# EAGLE design transistor-test-v3 (EAGLE 9.4.1)
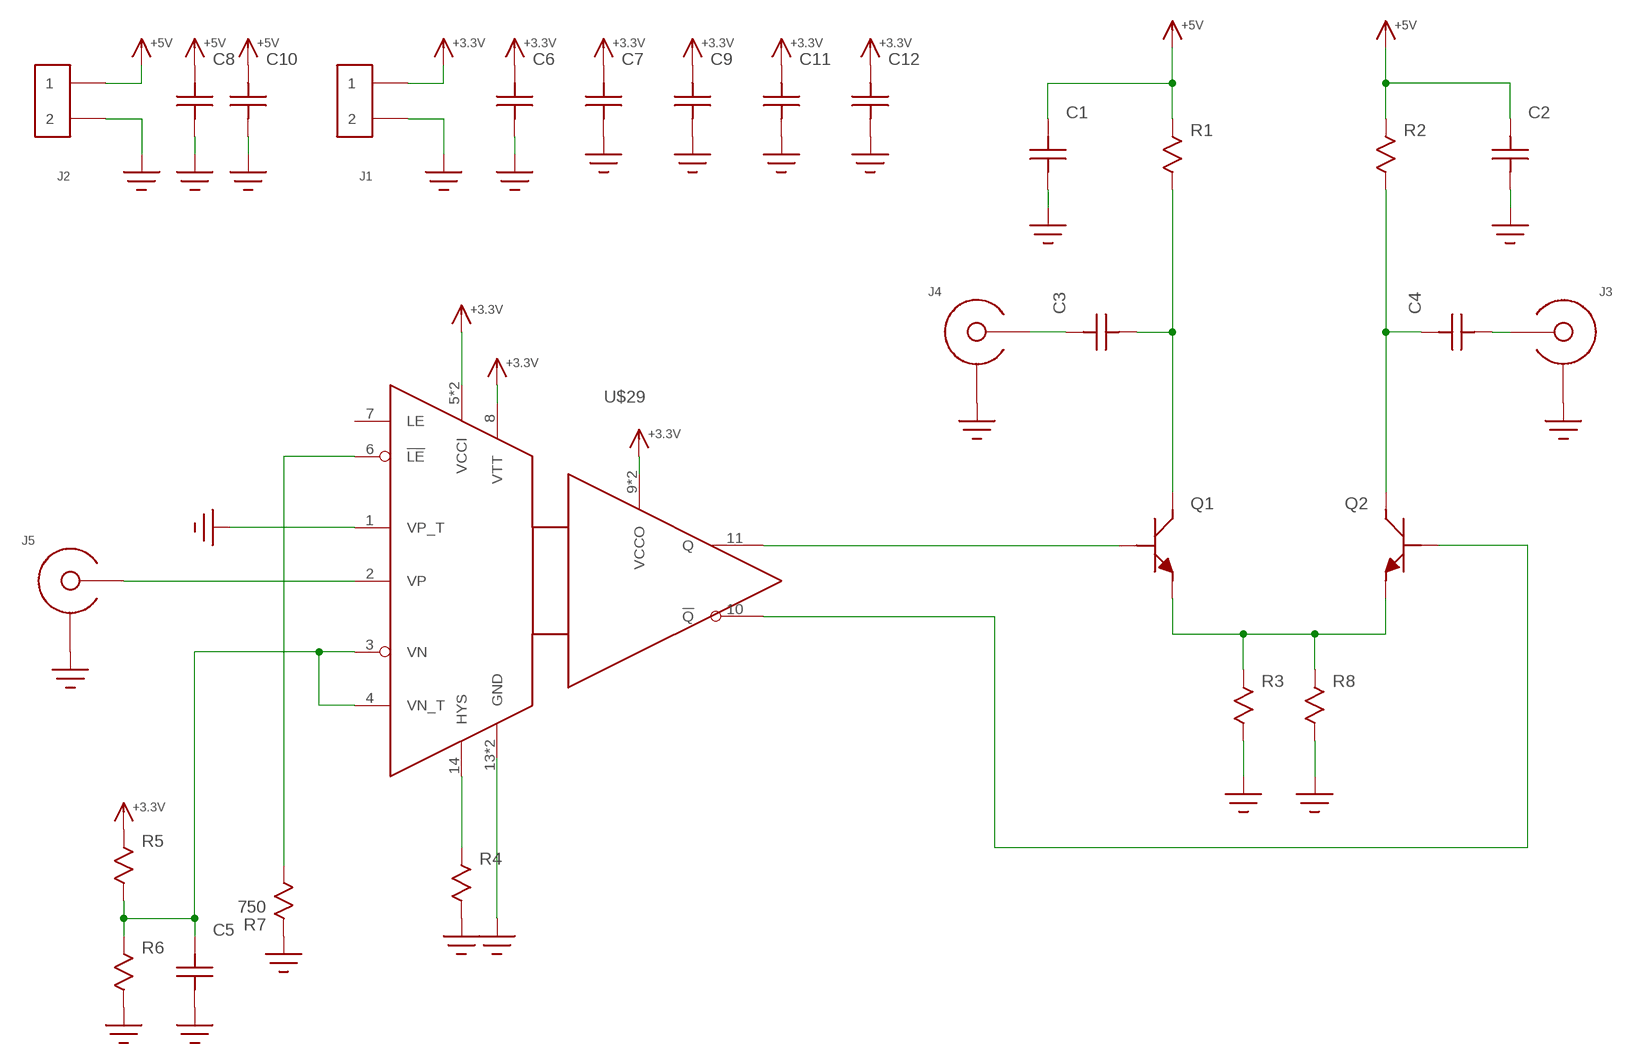
[diagram p0: schematic, sheet 1]

## Parts
C1  C0603  [C0603]
C2  C0603  [C0603]
C3  C0603  [C0603]
C4  C0603  [C0603]
C5  C0603  [C0603]
C6  C1206  [1206]
C7  C0603  [C0603]
C8  C1206  [1206]
C9  C0603  [C0603]
C10  C1206  [1206]
C11  C0603  [C0603]
C12  C0603  [C0603]
J1  HEADER_2PIN  [HEADER_2PIN]
J2  HEADER_2PIN  [HEADER_2PIN]
J3  SMA-EDGE-LAUNCH4L_4030_TAPER  [SMA_EDGE_LAUNCH_4L_4030_TAPER]
J4  SMA-EDGE-LAUNCH4L_4030_TAPER  [SMA_EDGE_LAUNCH_4L_4030_TAPER]
J5  SMA-EDGE-LAUNCH4L_4030_TAPER  [SMA_EDGE_LAUNCH_4L_4030_TAPER]
Q1  MCH4020  [SOT343]
Q2  MCH4020  [SOT343]
R1  R0603  [R0603]
R2  R0603  [R0603]
R3  R0603  [R0603]
R4  R0603  [R0603]
R5  R0603  [R0603]
R6  R0603  [R0603]
R7  750  R0603  [R0603]
R8  R0603  [R0603]
U$29  ADCMP572  [TQFN16-EP]

## Nets
+3.3V: C6.P$2 C7.P$2 C9.P$2 C11.P$2 C12.P$2 J1.1 R5.P$1 U$29.5(VCCI) U$29.8(VTT) U$29.9(VCCO) U$29.12(VCCO) U$29.16(VCCI)
+5V: C1.P$2 C2.P$2 C8.P$2 C10.P$2 J2.1 R1.P$1 R2.P$1
GND: C1.P$1 C2.P$1 C5.P$1 C6.P$1 C7.P$1 C8.P$1 C9.P$1 C10.P$1 C11.P$1 C12.P$1 J1.2 J2.2 J3.BOTTOM_GND(SHIELD) J3.GND@1(SHIELD) J3.GND@2(SHIELD) J3.GND@3(SHIELD) J3.GND@4(SHIELD) J3.GND@5(SHIELD) J3.GND@6(SHIELD) J3.GND@7(SHIELD) J3.GND@8(SHIELD) J3.GND@14(SHIELD) J3.GND@15(SHIELD) J3.GND@16(SHIELD) J3.GND@17(SHIELD) J3.GND_PAD1(SHIELD) J3.GND_PAD2(SHIELD) J3.P$1(SHIELD) J3.P$2(SHIELD) J4.BOTTOM_GND(SHIELD) J4.GND@1(SHIELD) J4.GND@2(SHIELD) J4.GND@3(SHIELD) J4.GND@4(SHIELD) J4.GND@5(SHIELD) J4.GND@6(SHIELD) J4.GND@7(SHIELD) J4.GND@8(SHIELD) J4.GND@14(SHIELD) J4.GND@15(SHIELD) J4.GND@16(SHIELD) J4.GND@17(SHIELD) J4.GND_PAD1(SHIELD) J4.GND_PAD2(SHIELD) J4.P$1(SHIELD) J4.P$2(SHIELD) J5.BOTTOM_GND(SHIELD) J5.GND@1(SHIELD) J5.GND@2(SHIELD) J5.GND@3(SHIELD) J5.GND@4(SHIELD) J5.GND@5(SHIELD) J5.GND@6(SHIELD) J5.GND@7(SHIELD) J5.GND@8(SHIELD) J5.GND@14(SHIELD) J5.GND@15(SHIELD) J5.GND@16(SHIELD) J5.GND@17(SHIELD) J5.GND_PAD1(SHIELD) J5.GND_PAD2(SHIELD) J5.P$1(SHIELD) J5.P$2(SHIELD) R3.P$2 R4.P$2 R6.P$2 R7.P$1 R8.P$2 U$29.1(VP_T) U$29.13(GND) U$29.15(GND)
N$3: Q1.2(E) Q1.4(E) Q2.2(E) Q2.4(E) R3.P$1 R8.P$1
N$4: R4.P$1 U$29.14(HYS)
N$5: Q2.3(B) U$29.10(!Q!)
N$6: C3.P$2 J4.CENTER@1(CENTER)
N$7: C4.P$1 J3.CENTER@1(CENTER)
N$8: C5.P$2 R5.P$2 R6.P$1 U$29.3(VN) U$29.4(VN_T)
N$9: R7.P$2 U$29.6(!LE!)
N$10: J5.CENTER@1(CENTER) U$29.2(VP)
N$11: C3.P$1 Q1.1(C) R1.P$2
N$12: C4.P$2 Q2.1(C) R2.P$2
N$13: Q1.3(B) U$29.11(Q)
Unconnected: U$29.7(LE)

## Library data of the parts
C1-C12 = yapo:C
J1 J2 = yapo:HEADER_2PIN
J3-J5 = sma_footprint_2l:SMA-EDGE-LAUNCH
Q1 Q2 = yapo:MCH4020
R1-R8 = yapo:R
U$29 = yapo:ADCMP572

## Net classes
1 50-ohm: width 0.356 mm, clearance 0.508 mm

## Board
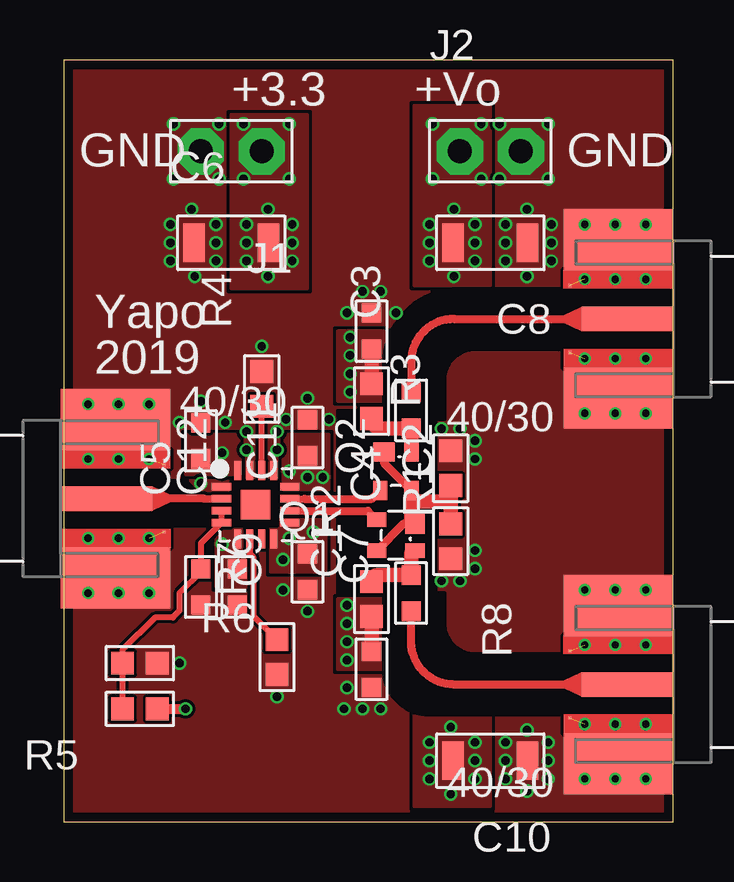
[diagram p1: board, top side]
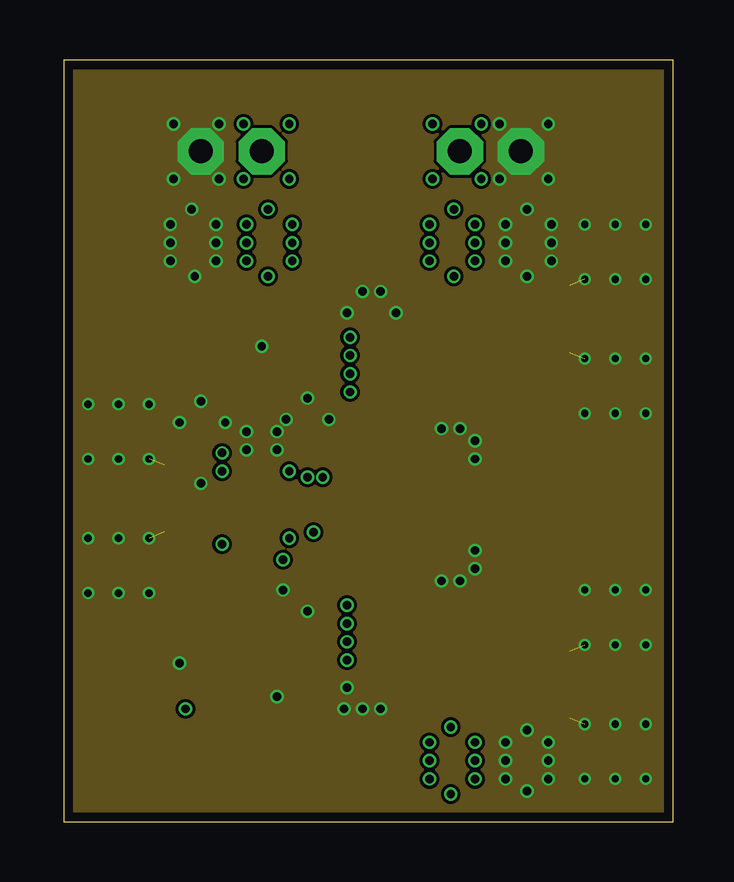
[diagram p2: board, inner layer Route2]
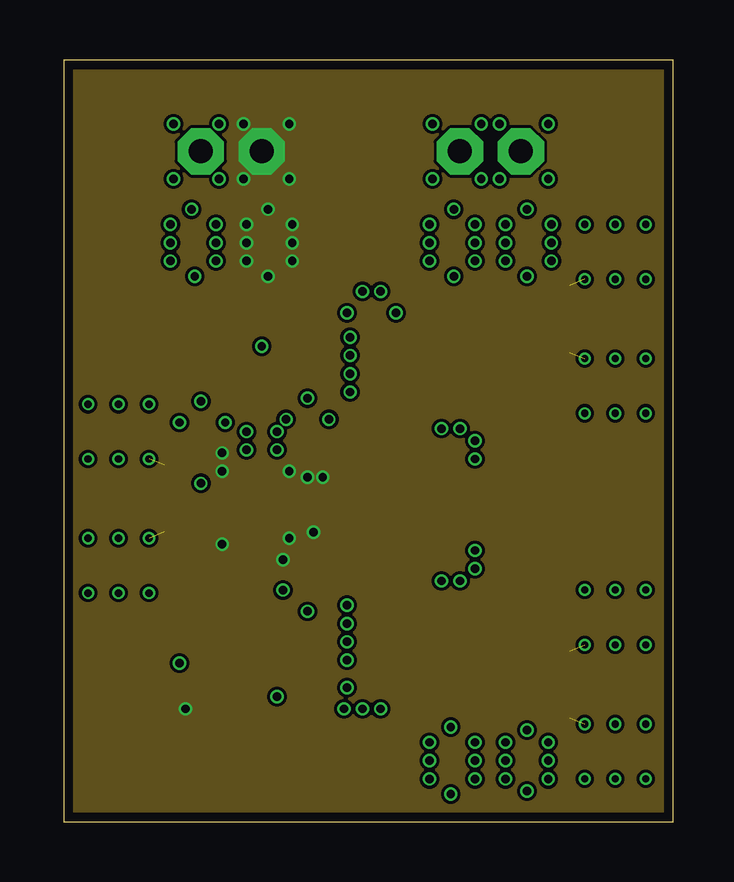
[diagram p3: board, inner layer Route15]
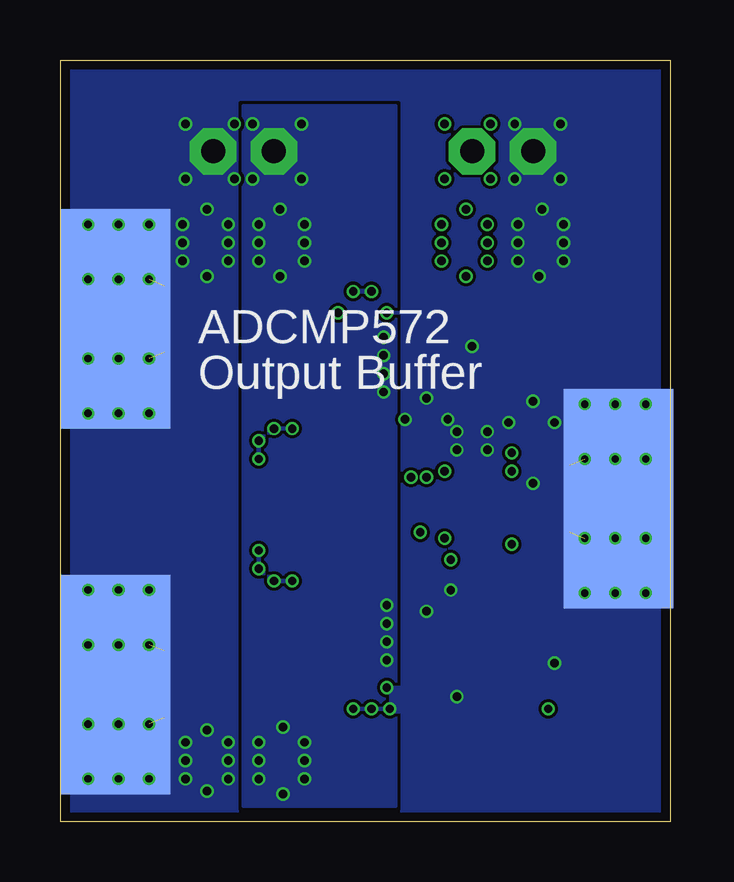
[diagram p4: board, bottom side, seen from below]

Size 25.4 x 31.75 mm. Coordinates in mm from the lower left corner, seen from the top.
Outline: 0,0 25.4,0 25.4,31.75 0,31.75 0,0
Copper layers (1*2*15*16): Top 0.035559375mm / dielectric 0.17018125mm / Route2 0.01778125mm / dielectric 47mil / Route15 0.01778125mm / dielectric 0.17018125mm / Bottom 0.035559375mm
Design rules "oshpark-4layer *": minimum track width 5mil, minimum drill 10mil, track to track 5mil, track to pad 5mil, pad to pad 5mil, via to via 5mil, smd to smd 5mil, copper to edge 15mil, drill to drill 6mil, minimum pad ring 4mil, minimum via ring 4mil, stop-mask expansion 2.5mil, vias tented up to drill 20mil, thermal gap 10mil

### Footprints (pad centres in the part's own frame; a part is rotated, then mirrored left to right if it is on the bottom)
C0603 = smd 0.8 x 0.8: P$1 -0.75,0; P$2 0.75,0
1206 = smd 0.9 x 1.6: P$1 -1.55,0; P$2 1.55,0
HEADER_2PIN = drill 1 pad 1.93 octagon: 1 -1.27,0; 2 1.27,0
SMA_EDGE_LAUNCH_4L_4030_TAPER = smd 4.572 x 9.144 bottom: BOTTOM_GND 2.286,0 | smd 3.81 x 1.016: CENTER@1 1.905,0 | drill 0.3: GND@1 1.143,3.937; GND@2 3.683,3.937; GND@3 1.143,1.651; GND@4 3.683,1.651; GND@5 1.143,-1.651; GND@6 3.683,-1.651; GND@7 1.143,-3.937; GND@8 3.683,-3.937; GND@14 2.413,3.937; GND@15 2.413,-3.937; GND@16 2.413,-1.651; GND@17 2.413,1.651 | smd 4.572 x 2.54: GND_PAD1 2.286,3.302; GND_PAD2 2.286,-3.302 | smd 0.127 x 0.127: P$1 4.318,1.397; P$2 4.318,-1.397
SOT343 = smd 0.6 x 0.8: 1 -0.65,-0.8; 3 0.65,0.8; 4 -0.65,0.8 | smd 0.9 x 0.8: 2 0.5,-0.8
R0603 = smd 0.95 x 0.95: P$1 -0.725,0; P$2 0.725,0
TQFN16-EP = smd 0.3 x 0.8: 1 -0.75,-1.425; 2 -0.25,-1.425; 3 0.25,-1.425; 4 0.75,-1.425; 9 0.75,1.425; 10 0.25,1.425; 11 -0.25,1.425; 12 -0.75,1.425 | smd 0.8 x 0.3: 5 1.425,-0.75; 6 1.425,-0.25; 7 1.425,0.25; 8 1.425,0.75; 13 -1.425,0.75; 14 -1.425,0.25; 15 -1.425,-0.25; 16 -1.425,-0.75 | smd 1.23 x 1.23: EP 0,0

### Placement (x,y rotation side)
C1  12.83,6.35 90 top
C2  12.83,20.45 270 top
C3  14.48,17.14 90 top
C4  14.48,9.53 90 top
C5  5.71,9.78 90 top
C6  6.99,24.13 0 top
C7  10.16,16 270 top
C8  17.78,24.13 180 top
C9  5.71,15.88 270 top
C10  17.78,2.54 180 top
C11  10.16,10.41 90 top
C12  7.24,9.78 90 top
J1  6.99,27.94 180 top
J2  17.78,27.94 0 top
J3  25.4,5.71 180 top
J4  25.4,20.95 180 top
J5  -0.13,13.46 0 top
Q1  13.84,14.61 180 top
Q2  13.84,11.94 90 top
R1  12.83,17.53 270 top
R2  12.83,9.27 90 top
R3  16.13,14.73 90 top
R4  8.26,18.03 90 top
R5  3.17,4.7 180 top
R6  3.17,6.6 0 top
R7  8.89,6.86 90 top
R8  16.13,11.68 270 top
U$29  8,13.21 270 top

### Tracks (layer width: path | path; a pad name or v marks a point on that pad's centre or on a via)
+3.3V  (via drill 0.35)
  Top 0.406: R5.P$1 v5.08,4.7
  other vias: 9.4,11.81 9.14,10.92 10.41,12.06 6.6,11.56 6.6,14.61 9.4,14.61 6.6,15.37 10.16,14.35 10.79,14.35 7.49,29.08 9.4,29.08 9.4,26.8 7.49,26.8 8.51,25.53 8.51,22.73 7.62,24.89 7.62,24.13 7.62,23.37 9.53,24.89 9.53,24.13 9.53,23.37
  pour Route15 (no thermals): 0,0 25.4,0 25.4,31.75 0,31.75
  pour Top (no thermals): 6.99,29.46 6.99,22.23 10.16,22.23 10.16,29.46
  pour Top (no thermals): 8.89,12.32 8.64,12.32 8.64,10.41 10.92,10.41 10.92,12.57 8.89,12.57
  pour Top (no thermals): 7.62,12.32 6.35,12.32 6.35,9.78 7.62,9.78
  pour Top (no thermals): 5.08,16.13 7.37,16.13 7.37,14.48 5.08,14.48
  pour Top (no thermals): 9.14,13.84 9.14,16.13 11.05,16.13 11.05,13.84
+5V  (via drill 0.35)
  Top 0.61: C1.P$2 R2.P$1 | C2.P$2 R1.P$1
  other vias: 15.37,26.8 16.13,3.94 15.37,29.08 17.4,29.08 17.4,26.8 16.26,25.53 16.26,22.73 17.14,24.89 17.14,24.13 17.14,23.37 15.24,24.89 15.24,24.13 15.24,23.37 16.13,1.14 15.24,3.3 15.24,2.54 15.24,1.78 17.14,2.54 17.14,1.78 17.14,3.3 11.94,20.19 11.94,18.67 11.94,19.43 11.94,17.91 11.81,9.02 11.81,8.26 11.81,7.49 11.81,6.73
  pour Top (no thermals): 14.61,29.84 17.78,29.84 17.78,22.35 14.61,22.35
  pour Top (no thermals): 14.61,0.64 17.78,0.64 17.78,4.45 14.61,4.45
  pour Bottom (no thermals): 11.43,29.21 11.43,0.64 17.78,0.64 17.78,29.84 11.43,29.84
  pour Top (no thermals): 11.43,20.45 13.34,20.45 13.34,17.53 11.43,17.53
  pour Top (no thermals): 11.43,9.27 13.46,9.27 13.46,6.35 11.43,6.35
GND  (via drill 0.35)  (6 unrouted)
  other vias: 7.62,15.49 7.62,16.26 5.71,14.1 8.89,16.26 8.89,15.49 20.19,29.08 19.3,25.53 20.32,24.13 20.32,23.37 18.41,23.37 18.41,24.13 20.32,24.89 20.19,26.8 19.3,22.73 18.41,24.89 18.16,29.08 18.16,26.8 19.3,3.81 19.3,1.27 18.41,3.3 18.41,2.54 18.41,1.78 20.19,3.3 20.19,2.54 20.19,1.78 4.57,29.08 6.48,29.08 6.48,26.8 4.57,26.8 5.33,25.53 4.45,24.89 4.45,23.37 4.45,24.13 6.35,24.89 6.35,24.13 6.35,23.37 5.46,22.73 9.14,9.65 4.83,6.6 8.89,5.21 6.73,16.64 4.83,16.64 5.71,17.53 9.27,16.76 10.16,17.65 11.05,16.76 10.16,8.76 8.26,19.81 15.75,16.38 16.51,16.38 15.75,10.03 16.51,10.03 17.14,11.3 17.14,15.88 17.14,15.11 17.14,10.54 12.45,22.1 13.21,22.1 13.84,21.21 11.81,21.21 12.45,4.7 13.21,4.7 11.81,5.59 11.68,4.7
  pour Top (rank 2, no thermals): 0,0 25.4,0 25.4,31.75 0,31.75
  pour Route2 (no thermals): 0,0 25.4,0 25.4,31.75 0,31.75
  pour Bottom (rank 2, no thermals): 0,0 25.4,0 25.4,31.75 0,31.75
  cutout Top (no thermals): 4.45,14.22 5.08,14.22 5.71,13.59 6.35,13.59 6.35,12.32 4.45,12.32
  cutout Top (no thermals): 6.99,14.22 6.99,12.32 8.89,12.32 8.89,14.22
  cutout Top (no thermals): 20.95,22.23 16.51,22.23 arc90 13.34,19.05 13.34,16.76 15.88,16.76 15.88,18.41 arc-90 17.14,19.68 20.95,19.68
  cutout Top (no thermals): 20.95,4.45 15.24,4.45 arc-90 13.34,6.35 13.34,9.53 15.88,9.53 15.88,8.26 arc90 17.14,6.99 20.95,6.99
  cutout Top (no thermals): 11.43,17.14 15.49,17.14 15.49,9.53 11.43,9.53
N$3
  Top 0.343: Q1.2 13.34,14.96 Q1.4 | Q2.4 14.19,12.44 Q2.2
  Top 0.61: R3.P$1 16.13,13.34 | 16.13,13.34 R8.P$1 | Q1.4 14.49,13.34 | 14.49,13.34 14.49,12.59 arc90 Q2.2 | 16.13,13.34 14.49,13.34
N$4
  Top 0.254: U$29.14 R4.P$1
N$5
  Top 0.254: 10.03,12.96 10.28,12.96 arc-90 10.29,12.95
  Top 0.292: U$29.10 10.03,12.96
  Top 0.343: 10.03,12.96 12.67,12.96 Q2.3
N$6
  Top 0.343: J4.CENTER@1 16.26,20.95 arc90 14.48,19.18 C3.P$2
N$7
  Top 0.343: J3.CENTER@1 16.26,5.71 arc-90 14.48,7.49 C4.P$1
N$8
  Top 0.254: U$29.3 U$29.4 5.71,11.6 C5.P$2 5.71,10.41 4.83,9.53 4.83,8.79 4.55,8.51 3.81,8.51 2.45,7.15 R6.P$1 R5.P$2
N$9
  Top 0.254: R7.P$2 7.89,8.58 7.89,11.03 7.75,11.18 U$29.6
N$10
  Top 0.254: 5.84,13.46
  Top 0.305: U$29.2 5.84,13.46
  Top 0.343: 5.84,13.46 J5.CENTER@1
N$11
  Top 0.61: Q1.1 arc-90 14.48,15.42 C3.P$1 13.23,16.39 arc-90 R1.P$2
N$12
  Top 0.61: Q2.1 arc90 14.48,11.12 C4.P$2 13.11,10.28 arc90 R2.P$2
N$13
  Top 0.254: 10.03,13.46 10.16,13.46
  Top 0.292: U$29.11 10.03,13.46
  Top 0.343: 10.03,13.46 12.85,13.46 Q1.3

### Text on the board
tPlace: +3.3 | +Vo | GND | GND | Yapo | 2019
bPlace: ADCMP572 | Output Buffer